# Altium schematic sheet MC.SchDoc
size Tabloid; Date: Date; Author: Author 1; Revision: 1; Size: 11x17; Sheet_Name: Sheet Description
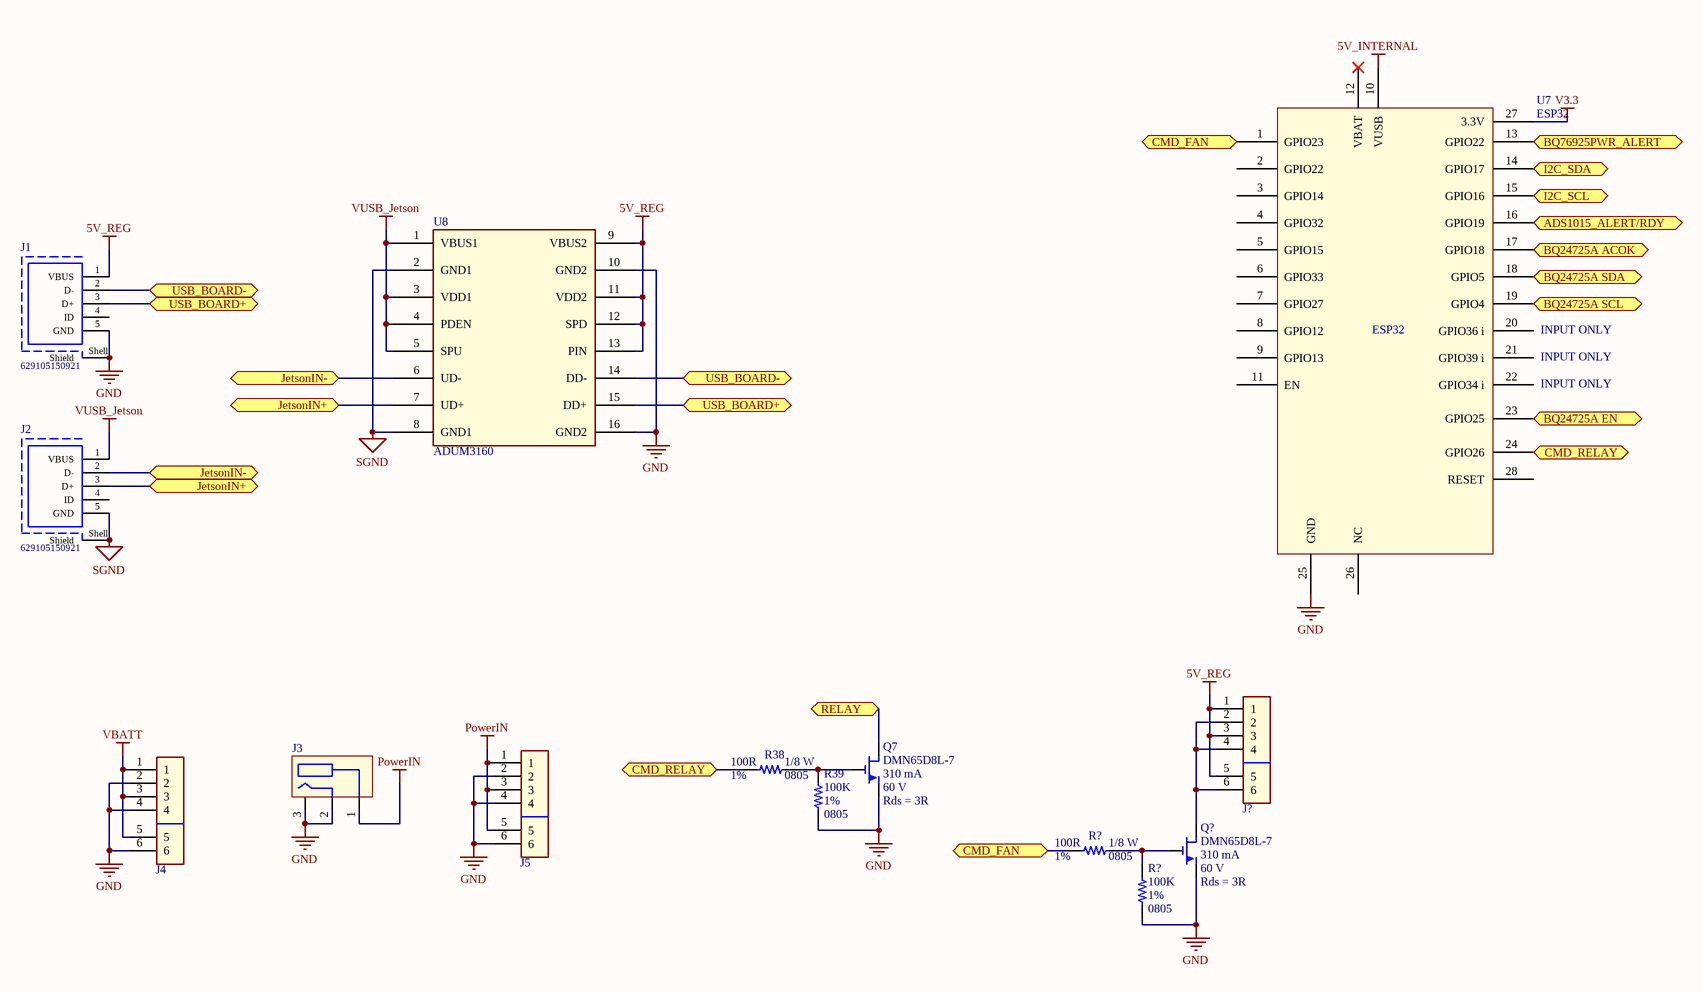
[diagram p0: MC.SchDoc]

## Parts
(Parts that share a designator on the sheet are numbered #1, #2 ... from top to bottom, then left to right.)
J1  629105150921  [629105150921]
J2  629105150921  [629105150921]
J3  Barrel 5.5x2.5mm  [Barrel 5.5mm 2.5mm]  (value not drawn)
J4  MOLEX 4 POS - TERMINAL BLOCK 2 POS  [MOLEX4POS_TERMBLOCK2POS]  (value not drawn)
J5  MOLEX 4 POS - TERMINAL BLOCK 2 POS  [MOLEX4POS_TERMBLOCK2POS]  (value not drawn)
J?  MOLEX 4 POS - TERMINAL BLOCK 2 POS  [MOLEX4POS_TERMBLOCK2POS]  (value not drawn)
Q7  Part number: DMN65D8L-7  A max: 310 mA  Vds max: 60 V  Ron: Rds = 3R  [SOT-23]  (hidden comment: NMOS)
Q?  Part number: DMN65D8L-7  A max: 310 mA  Vds max: 60 V  Ron: Rds = 3R  [SOT-23]  (hidden comment: NMOS)
R38  value 100R  Watt: 1/8 W  Tolerance: 1%  Package: 0805  [RES_0805]  (hidden comment: RES - 0805)
R39  value 100K  Tolerance: 1%  Package: 0805  [RES_0805]  (hidden comment: RES - 0805)
R?#1  value 100R  Watt: 1/8 W  Tolerance: 1%  Package: 0805  [RES_0805]  (hidden comment: RES - 0805)
R?#2  value 100K  Tolerance: 1%  Package: 0805  [RES_0805]  (hidden comment: RES - 0805)
U7  ESP32  [ESP32 V1]
U8  ADUM3160  [SOIC16]

## Ports
ADS1015_ALERT/RDY, BQ24725A ACOK, BQ24725A EN, BQ24725A SCL, BQ24725A SDA, BQ76925PWR_ALERT, CMD_FAN, CMD_RELAY, I2C_SCL, I2C_SDA, JetsonIN+, JetsonIN-, RELAY, USB_BOARD+, USB_BOARD-

## Nets
5V_INTERNAL: U7.10(VUSB)
5V_REG: J1.1(VBUS) J?.1 J?.3 J?.5 U8.9(VBUS2) U8.11(VDD2) U8.12(SPD) U8.13(PIN)
GND: J1.5(GND) J1.Shell(Shield) J3.2 J3.3 J4.2 J4.4 J4.6 J5.2 J5.4 J5.6 Q7.1 Q?.1 R39.1 R?#2.1 U7.25(GND) U8.10(GND2) U8.16(GND2)
PowerIN: J3.1 J5.1 J5.3 J5.5
SGND: J2.5(GND) J2.Shell(Shield) U8.2(GND1) U8.8(GND1)
V3.3: U7.27(3.3V)
VBATT: J4.1 J4.3 J4.5
VUSB_Jetson: J2.1(VBUS) U8.1(VBUS1) U8.3(VDD1) U8.4(PDEN) U8.5(SPU)
ADS1015_ALERT/RDY: U7.16(GPIO19) ; port ADS1015_ALERT/RDY
BQ24725A ACOK: U7.17(GPIO18) ; port BQ24725A ACOK
BQ24725A EN: U7.23(GPIO25) ; port BQ24725A EN
BQ24725A SCL: U7.19(GPIO4) ; port BQ24725A SCL
BQ24725A SDA: U7.18(GPIO5) ; port BQ24725A SDA
BQ76925PWR_ALERT: U7.13(GPIO22) ; port BQ76925PWR_ALERT
CMD_FAN: R?#1.1 U7.1(GPIO23) ; port CMD_FAN
CMD_RELAY: R38.1 U7.24(GPIO26) ; port CMD_RELAY
I2C_SCL: U7.15(GPIO16) ; port I2C_SCL
I2C_SDA: U7.14(GPIO17) ; port I2C_SDA
JetsonIN+: J2.3(D+) U8.7(UD+) ; port JetsonIN+
JetsonIN-: J2.2(D-) U8.6(UD-) ; port JetsonIN-
RELAY: Q7.3 ; port RELAY
USB_BOARD+: J1.3(D+) U8.15(DD+) ; port USB_BOARD+
USB_BOARD-: J1.2(D-) U8.14(DD-) ; port USB_BOARD-
NetJ?_2: J?.2 J?.4 J?.6 Q?.3
NetQ7_2: Q7.2 R38.2 R39.2
NetQ?_2: Q?.2 R?#1.2 R?#2.2

Not connected (* = marked no-connect by the designer): J1 4(ID); J2 4(ID); U7 2(GPIO22) 3(GPIO14) 4(GPIO32) 5(GPIO15) 6(GPIO33) 7(GPIO27) 8(GPIO12) 9(GPIO13) 11(EN) 12(VBAT)* 20(GPIO36_i) 21(GPIO39_i) 22(GPIO34_i) 26(NC) 28(RESET)

## Notes on the sheet
- (near U7) INPUT ONLY
- Sheet Name
- Project Title
- Global Project
- Size
- Group
- Revision
- Date
- Sheet
- of
- Filename
- Designers

## Library data of the parts
J1 J2 = 629105150921: Micro USB 2.0 Type AB Receptacle WR-COM, Horizontal, SMT; Rated Current: 1.8 A; Contact Resistance: 30 mOhm; Working Voltage: 30 VAC; ComponentLink1Description: Manufacturer; ComponentLink1URL: http://www.we-online.de; ComponentLink2Description: Datasheet; ComponentLink2URL: https://katalog.we-online.de/em/datasheet/629105150921.pdf; Part Number: 629105150921; Published Date: September 2018; Publisher: Wurth Elektronik; Orientation: Horizontal; Connector Type: Micro USB 2.0 Type AB; Operating Temperature: -40 to 85 degC; Mounting Technology: SMT; Gender: Receptacle; Packaging: Tape and Reel
J3 = Barrel 5.5x2.5mm: Jack 5.5x2.5mm; Part number: PJ-082BH
J4 J5 J? = MOLEX 4 POS - TERMINAL BLOCK 2 POS: Part number: 0039281043; Part number: OSTOQ023250
R38 R?#1 = RES - 0805: Part number: ERA-6AEB101V
R39 R?#2 = RES - 0805: Part number: RMCF0805FT100K; Watt: 1/8 W
U8 = ADUM3160: Part number: ADUM3160